# Altium schematic sheet MB1-Pwr-r1.0.SchDoc: Power
size A; DrawnBy: MBoard team; DocumentNumber: 4; Revision: 1.1; SheetNumber: 4; SheetTotal: 7
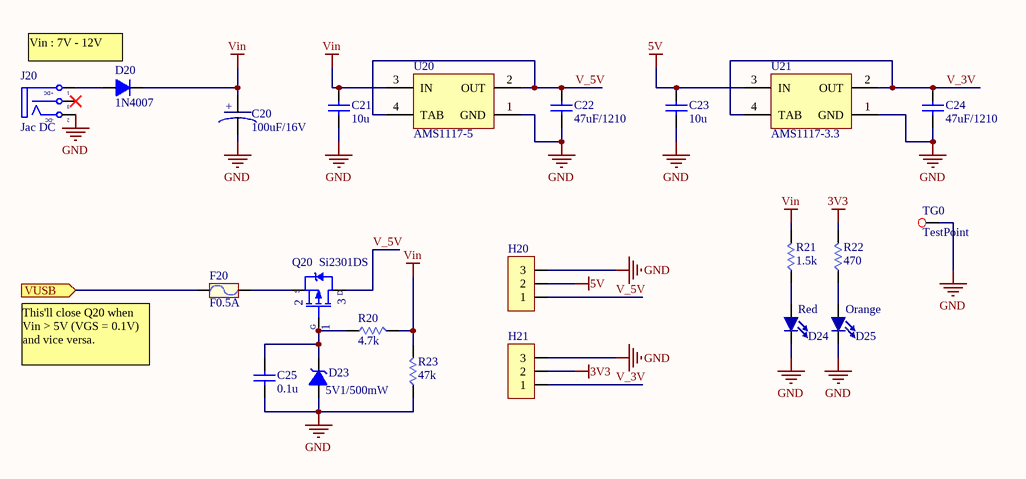
[diagram p0: MB1-Pwr-r1.0.SchDoc]

## Parts
C20  value 100uF/16V  [TantalumCaseD]  (hidden comment: CapT)
C21  value 10u  [SM_0805_LD]  (hidden comment: CAP Ceramic)
C22  value 47uF/1210  [SM-1210]  (hidden comment: CAP Ceramic)
C23  value 10u  [SM_0805_LD]  (hidden comment: CAP Ceramic)
C24  value 47uF/1210  [SM-1210]  (hidden comment: CAP Ceramic)
C25  value 0.1u  [SM_0805_LD]  (hidden comment: CAP Ceramic)
D20  1N4007  [DO-214AC]
D23  5V1/500mW  [SOD-123]
D24  Red  [SM_0805_POL_LD]
D25  Orange  [SM_0805_POL_LD]
F20  F0.5A  [SMD-1812]
H20  Hed3  [Hed3]  (value not drawn)
H21  Hed3  [Hed3]  (value not drawn)
J20  Jac DC  [DCJack]
Q20  Si2301DS  [SOT23]
R20  value 4.7k  [SM_0805_LD]
R21  value 1.5k  [SM_0805_LD]
R22  value 470  [SM_0805_LD]
R23  value 47k  [SM_0805_LD]
TG0  TestPoint  [TestPoint]
U20  AMS1117-5  [MP04A_N]
U21  AMS1117-3.3  [MP04A_N]

## Ports
VUSB (in)

## Nets
3V3: H21.2 R22.2
5V: C23.2 H20.2 U21.3(IN)
GND: C20.2(-) C21.1 C22.1 C23.1 C24.1 C25.1 D23.1(A) D24.2(K) D25.2(K) H20.3 H21.3 J20.2(TN) R23.1 TG0.1 U20.1(GND) U21.1(GND)
Vin: C20.1(+) C21.2 D20.2(K) R20.2 R21.2 R23.2 U20.3(IN)
V_3V: C24.2 H21.1 U21.2(OUT) U21.4(TAB)
V_5V: C22.2 H20.1 Q20.3(D) U20.2(OUT) U20.4(TAB)
VUSB: F20.1 ; port VUSB
NetC25_2: C25.2 D23.2(K) Q20.1(G) R20.1
NetD20_1: D20.1(A) J20.1(T)
NetD24_1: D24.1(A) R21.1
NetD25_1: D25.1(A) R22.1
NetF20_2: F20.2 Q20.2(S)

Not connected (* = marked no-connect by the designer): J20 3(S)*

## Notes on the sheet
- Vin : 7V - 12V
- This'll close Q20 when Vin > 5V (VGS = 0.1V) and vice versa.
- (in symbol DCIN) +DC; -DC

## Library data of the parts
C20 = CapA
C21-C25 = CAP Ceramic: Non-polarity ceramic capacitor; Published: 8-Jun-2000; LatestRevisionDate: 17-Jul-2002; LatestRevisionNote: Re-released for DXP Platform.; PackageReference: RAD-0.3; Publisher: Altium Limited; PackageDescription: Radial Cap, Thru-Hole; 2 Leads; 0.3 in Pin Spacing
D20 = D1A: Diode 1A; Value: 1N4007
D23 = DZ: Diode Zenner; Value: 5V1/500mW
D24 D25 = LED: Published: 8-Jun-2000; LatestRevisionDate: 08-Jul-2005; LatestRevisionNote: Mech Layer 1 removed.; PackageReference: LED-1; Publisher: Altium Limited; PackageDescription: LED; 2 Leads
F20 = Fuse: Designed by: VanDungEvn; Value: Fuse
J20 = DCIN: Jac DC input; Value: Jac DC
Q20 = P-MOSFET: P-Channel 1.25-W, 2.5-V MOSFET
R20-R23 = R: Resistor; Published: 8-Jun-2000; LatestRevisionDate: 29-May-2009; LatestRevisionNote: IPC-7351 Footprint Added.; PackageReference: J1-0603; Publisher: Altium Limited; PackageDescription: Chip Resistor
U20 U21 = LM1117IMP-3.3: 800mA Low-Dropout Linear Regulator, 4-pin SOT-223; Manufacturer: National Semiconductor; PackageTopMarking: XYTT*N05B; PowerWise: N; CompType: LDO IC; Published: 4-Dec-2008; DatasheetVersion: Apr-2006; PackageVersion: revB, Apr-2003; PackageReference: MP04A; Publisher: Altium Limited; PackageDescription: Molded SOT-223, 6.50 x 3.56 x 1.6mm Body, 4 Lead, 2.3mm Pitch; Supplier 1: Farnell; Supplier Part Number 1: 7614123; PartNumber: LM1117IMP-3.3; RoHS: N; PinCount: 4; Code_JEDEC: TO-261-AA; Code_IPC: SOT223-4; ComponentLink1Description: LM1117 Datasheet; ComponentLink1URL: http://www.national.com/ds/LM/LM1117.pdf; ComponentLink2Description: LM1117 Web Page; ComponentLink2URL: http://www.national.com/pf/LM/LM1117.html; ComponentLink3Description: MP04A Package Page; ComponentLink3URL: http://www.national.com/packaging/folders/mp04a.html